# Altium schematic sheet SmartWatch-V2-Sensors.SchDoc
size A4; DocumentNumber: 2; SheetNumber: 2; SheetTotal: 3
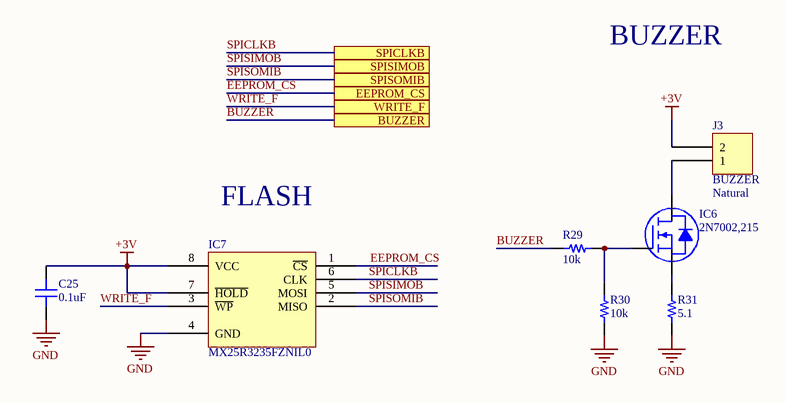
[diagram p0: SmartWatch-V2-Sensors.SchDoc]

## Parts
C25  0.1uF  [CAP 0402/1005]
IC6  2N7002,215  [NXP SOT-23-3 TO-236AB]
IC7  MX25R3235FZNIL0  [SPANSION WSON-8 6x5MM]
J3  BUZZER  Colour: Natural  [ST-025BH]
R29  10k  [RES 0402/1005]
R30  10k  [RES 0603/1608]
R31  5.1  [RES 0603/1608]

## Ports
BUZZER, EEPROM_CS, SPICLKB, SPISIMOB, SPISOMIB, WRITE_F

## Nets
+3V: C25.2 IC7.7(~{HOLD}) IC7.8(VCC) J3.2
GND: C25.1 IC7.4(GND) R30.1 R31.1
BUZZER: R29.2 ; port BUZZER
EEPROM_CS: IC7.1(~{CS}) ; port EEPROM_CS
SPICLKB: IC7.6(CLK) ; port SPICLKB
SPISIMOB: IC7.5(MOSI) ; port SPISIMOB
SPISOMIB: IC7.2(MISO) ; port SPISOMIB
WRITE_F: IC7.3(~{WP}) ; port WRITE_F
NetIC6_1: IC6.1(G) R29.1 R30.2
NetIC6_2: IC6.2(D) J3.1
NetIC6_3: IC6.3(S) R31.2

## Notes on the sheet
- BUZZER
- (near IC7) FLASH

## Library data of the parts
C25 = C1005X7R1C104K050BC: CAP CER 0.1UF 16V X7R 0402; Manufacturer: TDK Corporation; TemperatureRange: -55C ~ 125C; Tolerance: 10%; Value: 0.1uF; Part Number: C1005X7R1C104K050BC; PartId: 3856; Supplier 1: Digi-Key; Supplier Part Number 1: 445-4952-2-ND; ComponentLink1Description: Datasheet; ComponentLink1URL: https://product.tdk.com/info/en/catalog/datasheets/mlcc_commercial_general_en.pdf; ComponentLink2Description: Digi-Key listing; ComponentLink2URL: http://digikey.com/product-detail/en/C1005X7R1C104K050BC/445-4952-2-ND/2093220; TemperatureCoefficient: X7R; Voltage: 16V; Price: 0,0066; Type: -; Device Package: 0402 (1005 Metric)
IC6 = 2N7002,215: MOSFET N-CH 60V 300MA SOT-23; Manufacturer: NXP Semiconductors; Rds On (Max) at Id, Vgs: 5 Ohm @ 500mA, 10V; Vgs(th) (Max) at Id: 2.5V @ 250uA; Input Capacitance (Ciss) at Vds: 50pF @ 10V; Power - Max: 830mW; Current Continuous Drain: 300mA (Ta); Part Number: 2N7002,215; PartId: 7965; Supplier 1: Digi-Key; Supplier Part Number 1: 568-1369-2-ND; ComponentLink1Description: Datasheet; ComponentLink1URL: http://www.nxp.com/documents/data_sheet/2N7002.pdf; ComponentLink2Description: Digi-Key Listing; ComponentLink2URL: http://www.digikey.com/product-detail/en/2N7002,215/568-1369-2-ND/762973; Price: 0,0368; Type: MOSFET N-Channel, Metal Oxide; Device Package: TO-236-3, SC-59, SOT-23-3; Gate Charge (Qg): -; Drain to Source Voltage (Vdss): 60V; Features: Logic Level Gate
IC7 = S25FL116K0XNFI011: IC FLASH MEM 16MB SPI CMOS 8WSON; Manufacturer: Spansion; Memory Type: FLASH - NOR; Memory Size: 16M (2M x 8); Speed: 108MHz; Interface: SPI Serial; Voltage - Supply: 2.7 V ~ 3.6 V; Part Number: S25FL116K0XNFI011; PartId: 8258; Supplier 1: Digi-Key; Supplier Part Number 1: 1274-1131-ND; ComponentLink1Description: Datasheet; ComponentLink1URL: http://www.spansion.com/Support/Datasheets/S25FL1-K_00.pdf; ComponentLink2Description: Digi-Key Listing; ComponentLink2URL: http://www.digikey.com/product-detail/en/S25FL116K0XNFI011/1274-1131-ND/4517162; Price: 0,49; Type: FLASH - NOR; Device Package: 8-WDFN Exposed Pad; Operating Temperature: -40C ~ 85C
J3 = B2B-XH-A(LF)(SN): CONN HEADER XH TOP 2POS 2.5MM; Manufacturer: JST Sales America Inc.; Pitch: 0.098" (2.50mm); Number Of Positions: 2; Part Number: B2B-XH-A(LF)(SN); PartId: 16449; Supplier 1: Digi-Key; Supplier Part Number 1: 455-2247-ND; ComponentLink1Description: Datasheet; ComponentLink1URL: http://www.jst-mfg.com/product/pdf/eng/eXH.pdf; ComponentLink2Description: Digi-Key Listing; ComponentLink2URL: http://www.digikey.com/product-detail/en/jst-sales-america-inc/B2B-XH-A(LF)(SN)/455-2247-ND/1651045; Price: 0,15; Type: Header, Shrouded; Contact Finish: Tin; Fastening Type: Detent Lock; Number Of Rows: 1; Series: XH
R29 = ERA-2AED103X: RES SMD 10K OHM 0.5% 1/16W 0402; Manufacturer: Panasonic Electronic Components; TemperatureRange: -55C ~ 155C; TemperatureCoefficient: 25ppm/C; PowerRating: 0.063W, 1/16W; Value: 10k; Part Number: ERA-2AED103X; PartId: 540; Supplier 1: Digi-Key; Supplier Part Number 1: P10KDETR-ND; ComponentLink1Description: Datasheet; ComponentLink1URL: http://industrial.panasonic.com/lecs/www-data/pdf/AOA0000/AOA0000CE26.pdf; ComponentLink2Description: Digikey listing; ComponentLink2URL: http://digikey.com/product-detail/en/ERA-2AED103X/P10KDETR-ND/1706126; Tolerance: 0.5%; Price: 0,0353; Type: Thin Film; Device Package: 0402 (1005 Metric)
R30 = ERA-3AEB103V: RES SMD 10K OHM 0.1% 1/10W 0603; Manufacturer: Panasonic Electronic Components; TemperatureRange: -55C ~ 155C; TemperatureCoefficient: 25ppm/C; PowerRating: 0.1W, 1/10W; Value: 10k; Part Number: ERA-3AEB103V; PartId: 1432; Supplier 1: Digi-Key; Supplier Part Number 1: P10KDBTR-ND; ComponentLink1Description: Datasheet; ComponentLink1URL: http://industrial.panasonic.com/lecs/www-data/pdf/AOA0000/AOA0000CE26.pdf; ComponentLink2Description: Digi-Key listing; ComponentLink2URL: http://digikey.com/product-detail/en/ERA-3AEB103V/P10KDBTR-ND/1465878; Tolerance: 0.1%; Price: 0,055; Type: Thin Film; Device Package: 0603 (1608 Metric)
R31 = ERJ-3GEYJ5R1V: RES SMD 5.1 OHM 5% 1/10W 0603; Manufacturer: Panasonic Electronic Components; TemperatureRange: -55C ~ 155C; TemperatureCoefficient: -100/ +600ppm/C; PowerRating: 0.1W, 1/10W; Value: 5.1; Part Number: ERJ-3GEYJ5R1V; PartId: 11240; Supplier 1: Digi-Key; Supplier Part Number 1: P5.1GTR-ND; ComponentLink1Description: Datasheet; ComponentLink1URL: http://industrial.panasonic.com/www-cgi/jvcr13pz.cgi?E+PZ+3+AOA0001+ERJ3GEYJ5R1V+7+WW; ComponentLink2Description: Digi-Key Listing; ComponentLink2URL: https://www.digikey.com/product-detail/en/panasonic-electronic-components/ERJ-3GEYJ5R1V/P5.1GTR-ND/282128; Tolerance: 5%; Price: 0,002; Device Package: 0603 (1608 Metric)